# Altium schematic sheet 12.SchDoc
size 297 x 209 mm
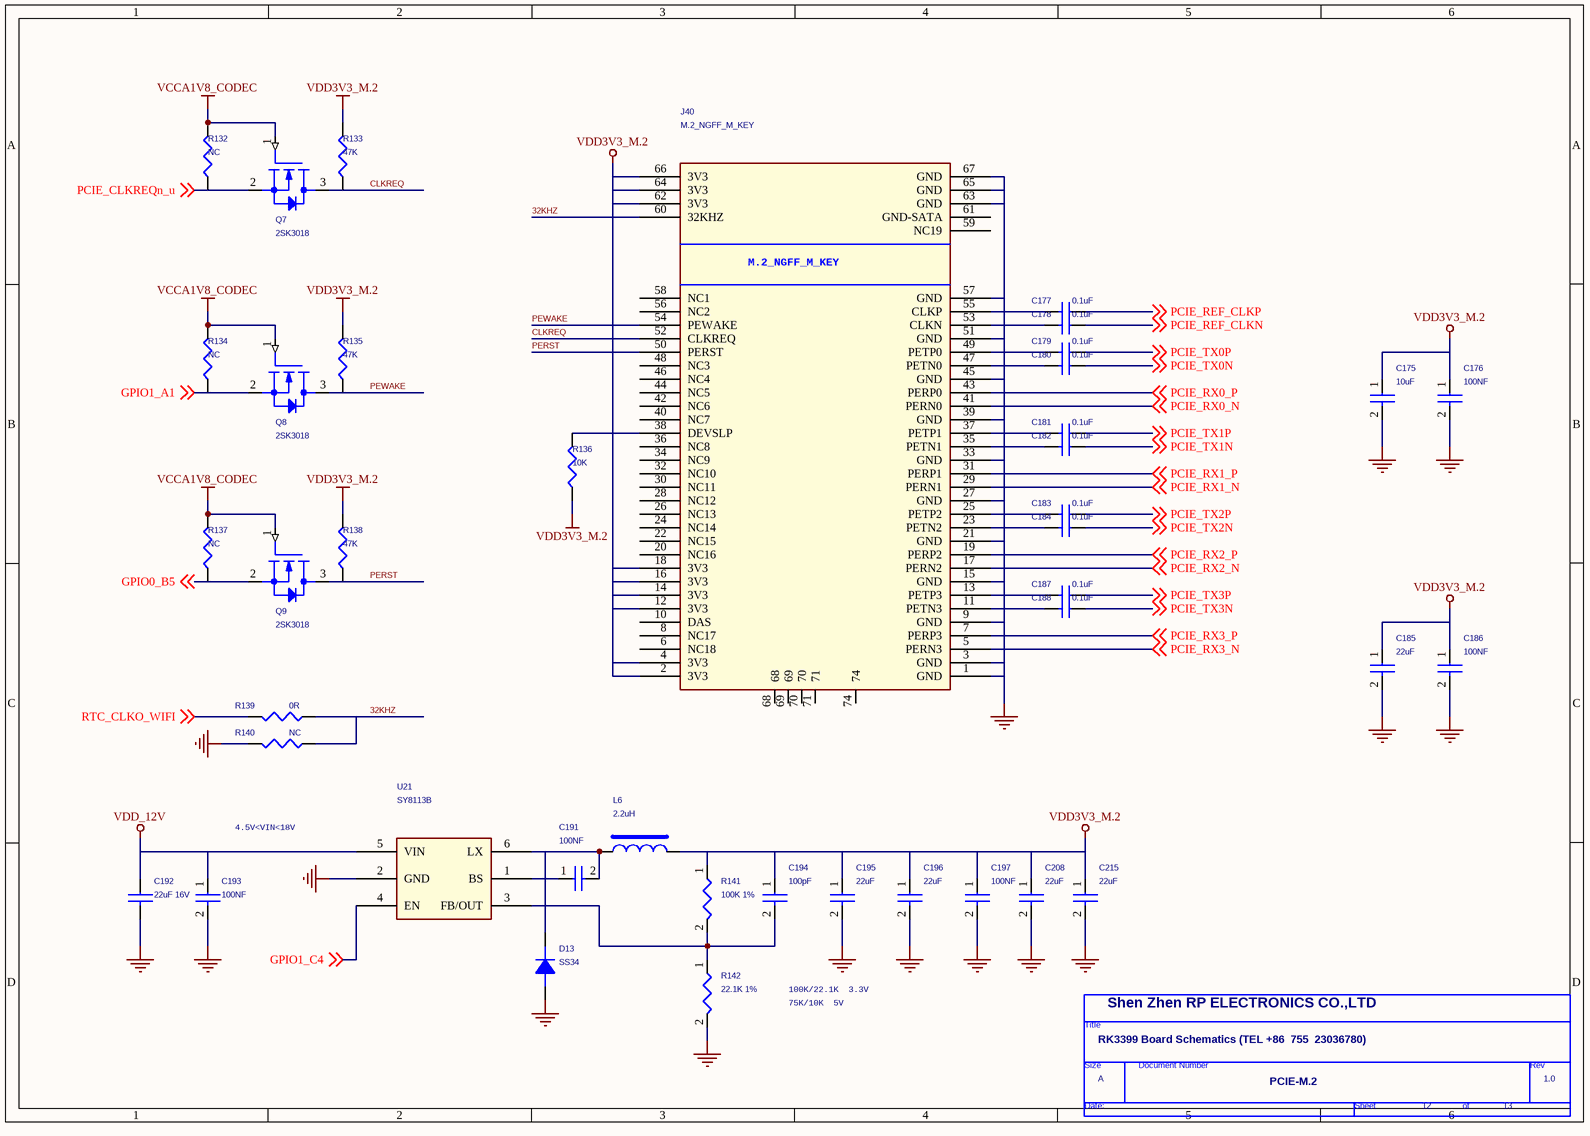
[diagram p0: 12.SchDoc]

## Parts
*  Doc: PCIE-M.2  RevCode: 1.0  Title: RK3399 Board Schematics (TEL +86  755  23036780)  Page Size: A  Page Number: 12  Page Count: 13  Cage Code: Shen Zhen RP ELECTRONICS CO.,LTD  (hidden comment: TitleBlock0)  (graphical)
C175  10uF  [0603_cc]
C176  100NF  [0402_cc]
C177  0.1uF  [0402_CC]
C178  0.1uF  [0402_CC]
C179  0.1uF  [0402_CC]
C180  0.1uF  [0402_CC]
C181  0.1uF  [0402_CC]
C182  0.1uF  [0402_CC]
C183  0.1uF  [0402_CC]
C184  0.1uF  [0402_CC]
C185  22uF  [0603_cc]
C186  100NF  [0402_cc]
C187  0.1uF  [0402_CC]
C188  0.1uF  [0402_CC]
C191  100NF  [0402_cc]
C192  22uF 16V  [C0805]
C193  100NF  [0402_cc]
C194  100pF  [0402_cc]
C195  22uF  [0603_cc]
C196  22uF  [0603_cc]
C197  100NF  [0402_cc]
C208  22uF  [0603_cc]
C215  22uF  [0603_cc]
D13  SS34  [DO-214AC]
J40  M.2_NGFF_M_KEY  [M2_NGFF_M_KEY1]
L6  2.2uH  [l5d18]
Q7  2SK3018  [SOT-23]
Q8  2SK3018  [SOT-23]
Q9  2SK3018  [SOT-23]
R132  NC  [0402_CC]
R133  47K  [0402_CC]
R134  NC  [0402_CC]
R135  47K  [0402_CC]
R136  10K  [0402_CC]
R137  NC  [0402_CC]
R138  47K  [0402_CC]
R139  0R  [0402_CC]
R140  NC  [0402_CC]
R141  100K 1%  [R0402]
R142  22.1K 1%  [R0402]
U21  SY8113B  [SOT23-6]

## Nets
GND: C175.2 C176.2 C185.2 C186.2 C192.2 C193.2 C195.2 C196.2 C197.2 C208.2 C215.2 D13.1(A) J40.1(GND) J40.3(GND) J40.9(GND) J40.15(GND) J40.21(GND) J40.27(GND) J40.33(GND) J40.39(GND) J40.45(GND) J40.51(GND) J40.57(GND) J40.63(GND) J40.65(GND) J40.67(GND) R140.1 R142.2 U21.2(GND)
VCCA1V8_CODEC: Q7.1(GATE) Q8.1(GATE) Q9.1(GATE) R132.1 R134.1 R137.1
VDD3V3_M.2: C175.1 C176.1 C185.1 C186.1 C194.1 C195.1 C196.1 C197.1 C208.1 C215.1 J40.2(3V3) J40.4(3V3) J40.12(3V3) J40.14(3V3) J40.16(3V3) J40.18(3V3) J40.62(3V3) J40.64(3V3) J40.66(3V3) L6.2 R133.1 R135.1 R136.2 R138.1 R141.1
VDD_12V: C192.1 C193.1 U21.5(VIN)
32KHZ: J40.60(32KHZ) R139.2 R140.2
CLKREQ: J40.52(CLKREQ) Q7.3(DRAIN) R133.2
GPIO0_B5: Q9.2(SOURCE) R137.2 ; off-sheet GPIO0_B5
GPIO1_A1: Q8.2(SOURCE) R134.2 ; off-sheet GPIO1_A1
GPIO1_C4: U21.4(EN) ; off-sheet GPIO1_C4
PCIE_CLKREQn_u: Q7.2(SOURCE) R132.2 ; off-sheet PCIE_CLKREQn_u
PCIE_REF_CLKN: C178.1 ; off-sheet PCIE_REF_CLKN
PCIE_REF_CLKP: C177.1 ; off-sheet PCIE_REF_CLKP
PCIE_RX0_N: J40.41(PERN0) ; off-sheet PCIE_RX0_N
PCIE_RX0_P: J40.43(PERP0) ; off-sheet PCIE_RX0_P
PCIE_RX1_N: J40.29(PERN1) ; off-sheet PCIE_RX1_N
PCIE_RX1_P: J40.31(PERP1) ; off-sheet PCIE_RX1_P
PCIE_RX2_N: J40.17(PERN2) ; off-sheet PCIE_RX2_N
PCIE_RX2_P: J40.19(PERP2) ; off-sheet PCIE_RX2_P
PCIE_RX3_N: J40.5(PERN3) ; off-sheet PCIE_RX3_N
PCIE_RX3_P: J40.7(PERP3) ; off-sheet PCIE_RX3_P
PCIE_TX0N: C180.1 ; off-sheet PCIE_TX0N
PCIE_TX0P: C179.1 ; off-sheet PCIE_TX0P
PCIE_TX1N: C182.1 ; off-sheet PCIE_TX1N
PCIE_TX1P: C181.1 ; off-sheet PCIE_TX1P
PCIE_TX2N: C184.1 ; off-sheet PCIE_TX2N
PCIE_TX2P: C183.1 ; off-sheet PCIE_TX2P
PCIE_TX3N: C188.1 ; off-sheet PCIE_TX3N
PCIE_TX3P: C187.1 ; off-sheet PCIE_TX3P
PERST: J40.50(PERST) Q9.3(DRAIN) R138.2
PEWAKE: J40.54(PEWAKE) Q8.3(DRAIN) R135.2
RTC_CLKO_WIFI: R139.1 ; off-sheet RTC_CLKO_WIFI
NetC177_2: C177.2 J40.55(CLKP)
NetC178_2: C178.2 J40.53(CLKN)
NetC179_2: C179.2 J40.49(PETP0)
NetC180_2: C180.2 J40.47(PETN0)
NetC181_2: C181.2 J40.37(PETP1)
NetC182_2: C182.2 J40.35(PETN1)
NetC183_2: C183.2 J40.25(PETP2)
NetC184_2: C184.2 J40.23(PETN2)
NetC187_2: C187.2 J40.13(PETP3)
NetC188_2: C188.2 J40.11(PETN3)
NetC191_1: C191.1 U21.1(BS)
NetC191_2: C191.2 D13.2(K) L6.1 U21.6(LX)
NetC194_2: C194.2 R141.2 R142.1 U21.3(FB/OUT)
NetJ40_38: J40.38(DEVSLP) R136.1

Not connected (* = marked no-connect by the designer): J40 6(NC18) 8(NC17) 10(DAS) 20(NC16) 22(NC15) 24(NC14) 26(NC13) 28(NC12) 30(NC11) 32(NC10) 34(NC9) 36(NC8) 40(NC7) 42(NC6) 44(NC5) 46(NC4) 48(NC3) 56(NC2) 58(NC1) 59(NC19) 61(GND-SATA) 68 69 70 71 74

## Notes on the sheet
- 4.5V<VIN<18V
- 100K/22.1K  3.3V
- 75K/10K  5V
- (in symbol TitleBlock0) Title; Size; Document Number; Rev; Date:; Sheet; of

## Library data of the parts
C175 C185 = CAP NP_Dup2: cap,10.00uF,+/-10%,10V,X5R,C0805; Manufacturer: TDK; RK PN: C2012X5R1A106K125AB; Priority: A; Tolerance: 10%; Voltage: 10V; Dielectric: X5R; Part Type: C0805; Manufacturer PN: C2012X5R1A106K125AB; Created by: JJJ
C176 C197 = CAP NP_Dup2: cap,100.00nF,+/-10%,16V,X5R,C0402; Manufacturer PN: C1005X5R1C104K050BA; Manufacturer: TDK; Tolerance: 10%; Priority: A; Voltage: 16V; Dielectric: X5R; Created by: JJJ; Part Type: C0402; RK PN: C1005X5R1C104K050BA
C177-C184 C187 C188 = SMALL CAP_Dup1
C186 = CAP NP_Dup2: cap,100.00nF,+/-10%,16V,X5R,C0402; Manufacturer: TDK; RK PN: C1005X5R1C104K050BA; Priority: A; Tolerance: 10%; Voltage: 16V; Dielectric: X5R; Part Type: C0402; Manufacturer PN: C1005X5R1C104K050BA; Created by: JJJ
C191 C193 = CAP NP_Dup2: cap,100.00nF,+/-10%,25V,X5R,C0402; Manufacturer PN: C1005X5R1E104K050BC; Manufacturer: TDK; Tolerance: 10%; Priority: A; Voltage: 25V; Dielectric: X5R; Created by: JJJ; Part Type: C0402; RK PN: C1005X5R1E104K050BC
C192 = CAP NP_Dup8
C194 = CAP NP_Dup2: cap,100.00pF,+/-5%,50V,C0G,C0402; Manufacturer PN: C1005C0G1H101J050BA; Manufacturer: TDK; Tolerance: 5%; Priority: A; Voltage: 50V; Dielectric: C0G; Created by: JJJ; Part Type: C0402; RK PN: C1005C0G1H101J050BA
C195 C208 C215 = CAP NP_Dup2: cap,22.00uF,+/-10%,10V,X5R,C0805; Manufacturer PN: C2012X5R1A226K125AB; Manufacturer: TDK; Tolerance: 10%; Priority: A; Voltage: 10V; Dielectric: X5R; Created by: JJJ; Part Type: C0805; RK PN: C2012X5R1A226K125AB
C196 = CAP NP_Dup2: cap,10.00uF,+/-10%,10V,X5R,C0805; Manufacturer PN: C2012X5R1A106K125AB; Manufacturer: TDK; Tolerance: 10%; Priority: A; Voltage: 10V; Dielectric: X5R; Created by: JJJ; Part Type: C0805; RK PN: C2012X5R1A106K125AB
D13 = DIODE_Dup1
J40 = M_0.2_NGFF_M_KEY
L6 = INDUCTORS OF FERRITE: Power Inductor,3.3uH,0.2,IND_404030; Manufacturer PN: SWPA4030S3R3MT; Manufacturer: sunlord; DC Resistor: 0.04ohm; Isat: 3.3A; Resonace frequency: 38M; Irms: 2.4A; Tolerance: 20%; Priority: A; Created by: YTL; Part Type: POWER_IND; RK PN: SWPA4030S3R3MT
Q7-Q9 = 2N6756_0
R132-R140 = R_Dup1
R141 = RESISTOR_Dup1: 通用厚膜电阻,75K,+/-1%,R0402,1/16W.; Manufacturer: YAGEO; RK PN: RC0402FR-0775KL; Priority: A; Wattage: 1/16W; Tolerance: 1%; Part Type: 通用厚膜电阻; Manufacturer PN: RC0402FR-0775KL; Created by: YTL
R142 = RESISTOR_Dup1: 通用厚膜电阻,10K,+/-1%,R0402,1/16W.; Manufacturer PN: RC0402FR-0710KL; Manufacturer: YAGEO; Wattage: 1/16W; Priority: A; Tolerance: 1%; Created by: YTL; Part Type: 通用厚膜电阻; RK PN: RC0402FR-0710KL
U21 = DCDC_SY8113: Manufacturer: Silergy（矽力杰）; Priority: A; Created by: JJJ; Manufacturer PN: SY8113B; Part Type: DCDC; RK PN: SY8113B
* = TitleBlock0: Page Create Date: March  8, 1995